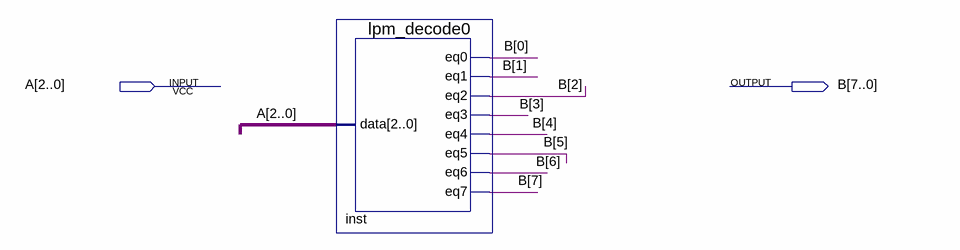
[diagram p0: schematic sheet]
// Quartus schematic color.bdf as structural Verilog: 1 symbols, 2 pins
module color (
  input  [2:0] A,
  output [7:0] B
);

  lpm_decode0 inst (
    .data(A), .eq0(B[0]), .eq1(B[1]), .eq2(B[2]), .eq3(B[3]), .eq4(B[4]), .eq5(B[5]), .eq6(B[6]), .eq7(B[7]));
endmodule
